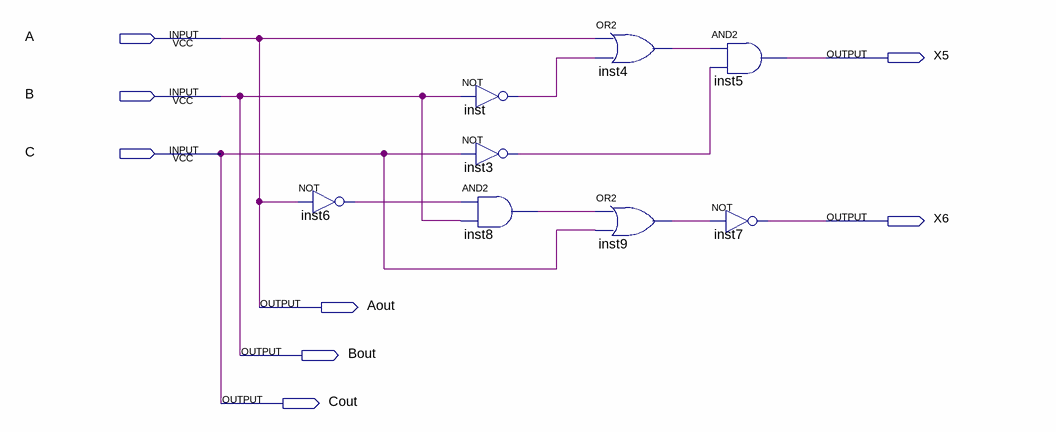
[diagram p0: schematic sheet]
// Quartus schematic Lab7.bdf as structural Verilog: 8 symbols, 8 pins
module Lab7 (
  input  A,
  input  B,
  input  C,
  output X5,
  output X6,
  output Aout,
  output Bout,
  output Cout
);

  wire inst3_out, inst4_out, inst6_out, inst8_out, inst9_out, inst_out;

  not inst6 (inst6_out, A);
  not inst (inst_out, B);
  not inst3 (inst3_out, C);
  and inst8 (inst8_out, inst6_out, B);
  or inst4 (inst4_out, A, inst_out);
  or inst9 (inst9_out, inst8_out, C);
  and inst5 (X5, inst4_out, inst3_out);
  not inst7 (X6, inst9_out);

  assign Aout = A;
  assign Bout = B;
  assign Cout = C;
endmodule
